# EAGLE design ble-v-monitor (EAGLE 7.2.0)
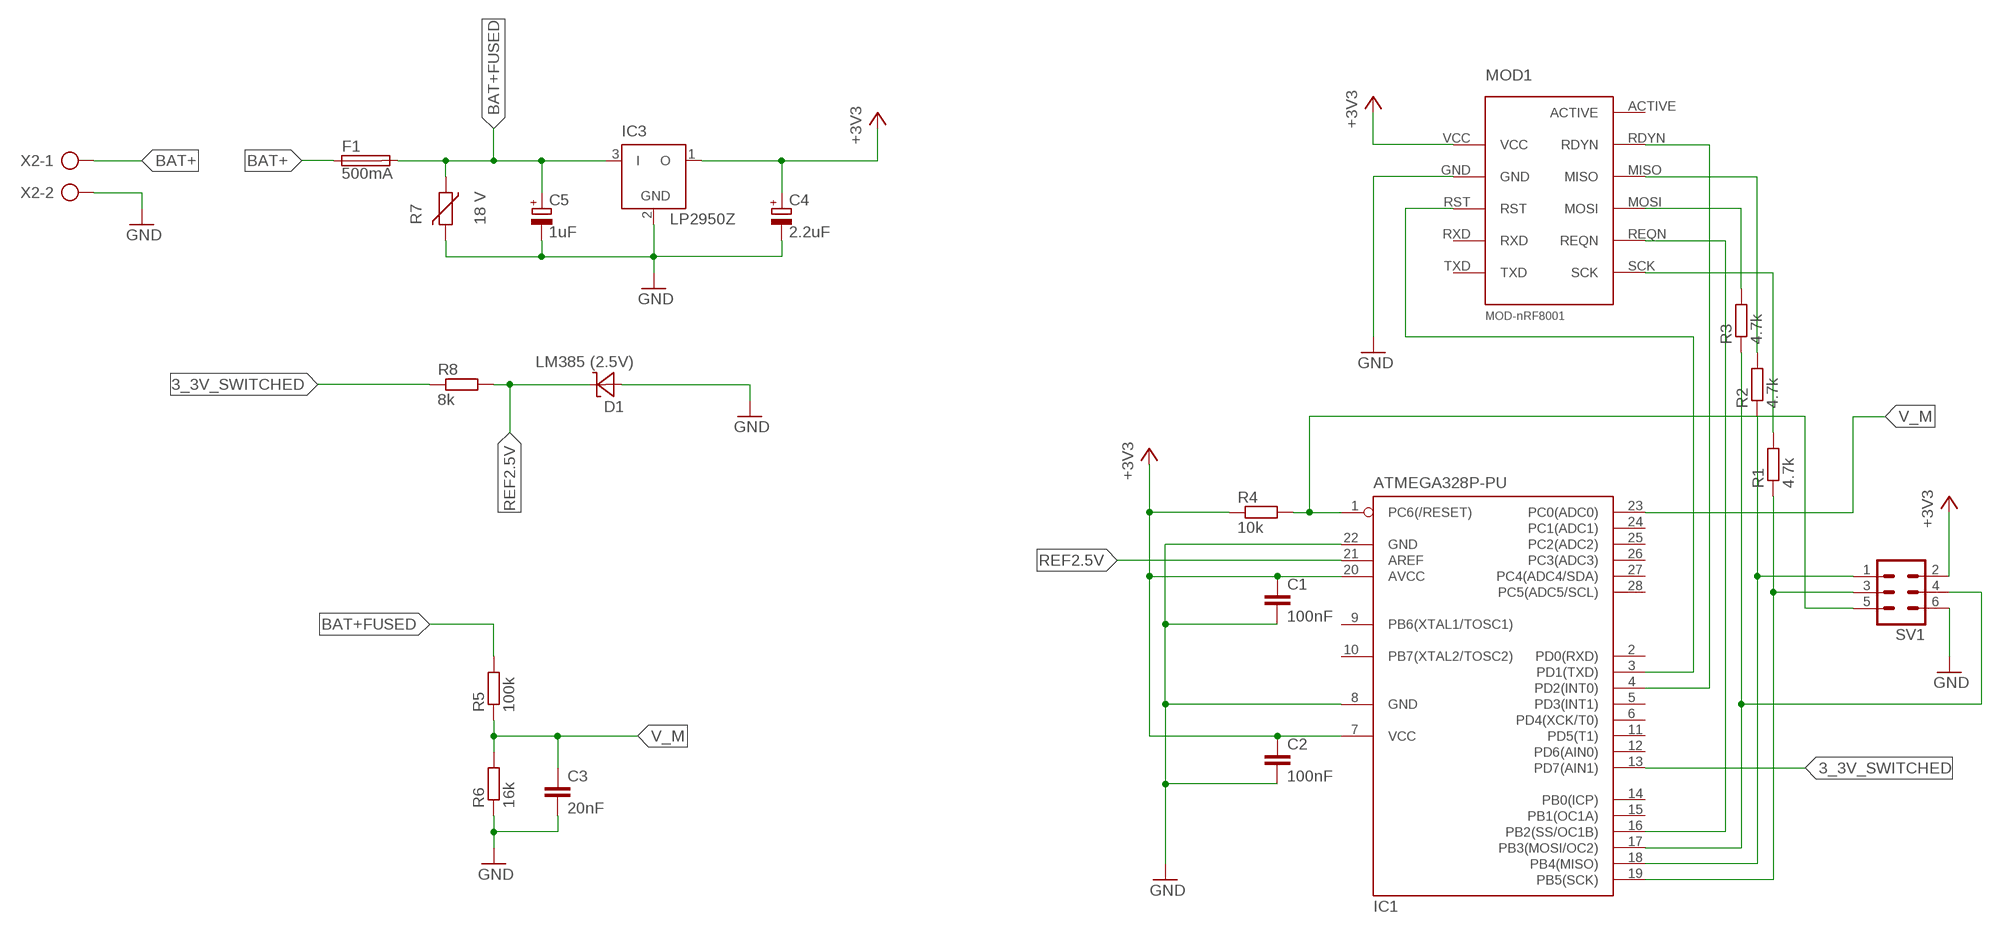
[diagram p0: schematic, sheet 1]

## Parts
C1  100nF  C-EU050-024X044  [C050-024X044]
C2  100nF  C-EU050-024X044  [C050-024X044]
C3  20nF  C-EU050-024X044  [C050-024X044]
C4  2.2uF  CPOL-EUTT2D5  [TT2D5]
C5  1uF  CPOL-EUTT2D5  [TT2D5]
D1  LM385 (2.5V)  LM385  [TO-92]
F1  500mA  SH22,5  [SH22,5]
IC1  ATMEGA328P-PU  MEGA8-P  [DIL28-3]
IC3  LP2950Z  [TO92]
MOD1  MOD-NRF8001MOD-NRF8001  [MOD-NRF8001]
R1  4.7k  R-EU_0207/7  [0207/7]
R2  4.7k  R-EU_0207/7  [0207/7]
R3  4.7k  R-EU_0207/7  [0207/7]
R4  10k  R-EU_0207/7  [0207/7]
R5  100k  R-EU_0207/7  [0207/7]
R6  16k  R-EU_0207/7  [0207/7]
R7  18 V  VARISTORCN0805  [CT/CN0805]
R8  8k  R-EU_0207/7  [0207/7]
SV1  MA03-2  [MA03-2]
X2  AK500/2  [AK500/2]

## Nets
3_3V_SWITCHED: IC1.13(PD7(AIN1)) R8.1
+3V3: C1.1 C2.1 C4.+ IC1.7(VCC) IC1.20(AVCC) IC3.1(O) MOD1.VCC R4.1 SV1.2
BAT+: F1.1 X2.1
BAT+FUSED: C5.+ F1.2 IC3.3(I) R5.2 R7.1
GND: C1.2 C2.2 C3.2 C4.- C5.- D1.+ IC1.8(GND) IC1.22(GND) IC3.2(GND) MOD1.GND R6.1 R7.2 SV1.6 X2.2
N$1: MOD1.MOSI R3.2
N$2: IC1.1(PC6(/RESET)) R4.2 SV1.5
N$4: MOD1.SCK R1.2
N$5: IC1.19(PB5(SCK)) R1.1 SV1.3
N$6: MOD1.MISO R2.2
N$8: IC1.16(PB2(SS/OC1B)) MOD1.REQN
N$10: IC1.17(PB3(MOSI/OC2)) R3.1 SV1.4
N$11: IC1.3(PD1(TXD)) MOD1.RST
N$12: IC1.18(PB4(MISO)) R2.1 SV1.1
N$16: IC1.4(PD2(INT0)) MOD1.RDYN
REF2.5V: D1.- IC1.21(AREF) R8.2
V_M: C3.1 IC1.23(PC0(ADC0)) R5.1 R6.2
Unconnected: IC1.2(PD0(RXD)) IC1.5(PD3(INT1)) IC1.6(PD4(XCK/T0)) IC1.9(PB6(XTAL1/TOSC1)) IC1.10(PB7(XTAL2/TOSC2)) IC1.11(PD5(T1)) IC1.12(PD6(AIN0)) IC1.14(PB0(ICP)) IC1.15(PB1(OC1A)) IC1.24(PC1(ADC1)) IC1.25(PC2(ADC2)) IC1.26(PC3(ADC3)) IC1.27(PC4(ADC4/SDA)) IC1.28(PC5(ADC5/SCL)) MOD1.ACTIVE MOD1.RXD MOD1.TXD

## Library data of the parts
C1-C3 = rcl:C-EU: CAPACITOR, European symbol
C4 C5 = rcl:CPOL-EU: POLARIZED CAPACITOR, European symbol
D1 = lm385:LM385: LM385 LM385 Micropower Voltage Reference
F1 = fuse:SH22,5: FUSE HOLDER grid 22,5 mm, OGN0031 8201, Schurter (Buerklin); MF: SCHURTER; MPN: 0031.8201; OC_FARNELL: 1162740; OC_NEWARK: 96F8317
IC1 = atmel:MEGA8-P: MICROCONTROLLER 8 Kbytes FLASH, 1 kbytes SRAM, 512 bytes EEPROM, USART, 4-channel 10 bit ADC, 2-channel 8 bit ADC Pin compatible with Atmega48, ATMega88, ATMega168 Source: avr.lbr; OC_FARNELL: unknown; OC_NEWARK: unknown
IC3 = linear:LP2950: 100 mA, Low Power Low Dropout Voltage Regulator Source: http://www.onsemi.com/pub/Collateral/LP2950-D.PDF
MOD1 = frankduerr:MOD-NRF8001
R1-R6 R8 = rcl:R-EU_: RESISTOR, European symbol
R7 = varistor:VARISTOR: VARISTOR
SV1 = con-lstb:MA03-2: PIN HEADER; OC_FARNELL: unknown; OC_NEWARK: unknown
X2 = con-ptr500:AK500/2: CONNECTOR; OC_FARNELL: unknown; OC_NEWARK: unknown

## Board
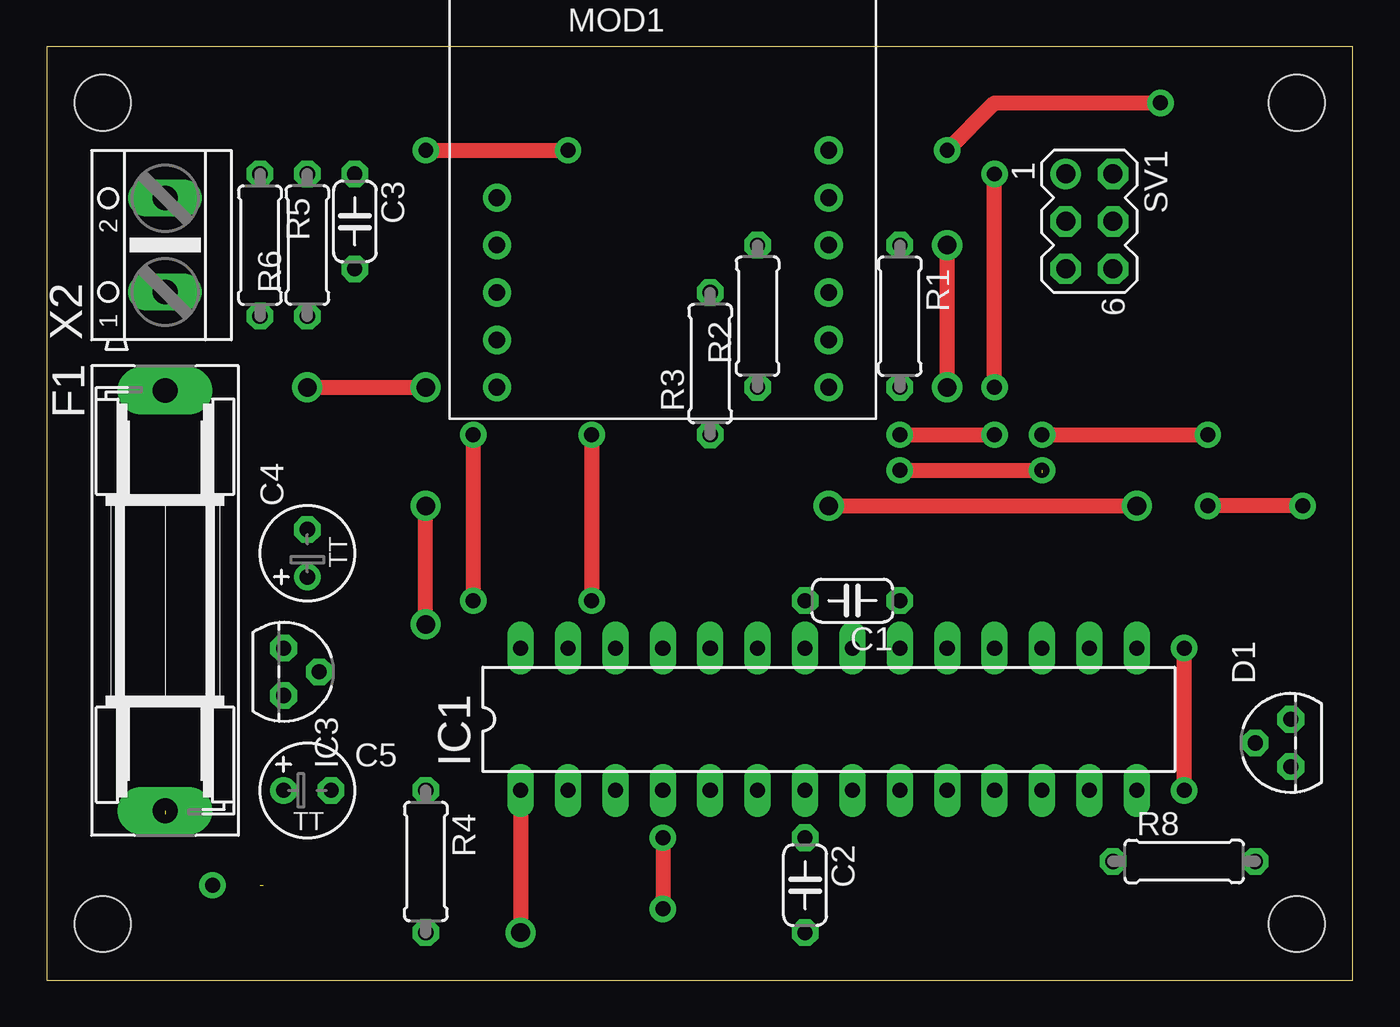
[diagram p1: board, top side]
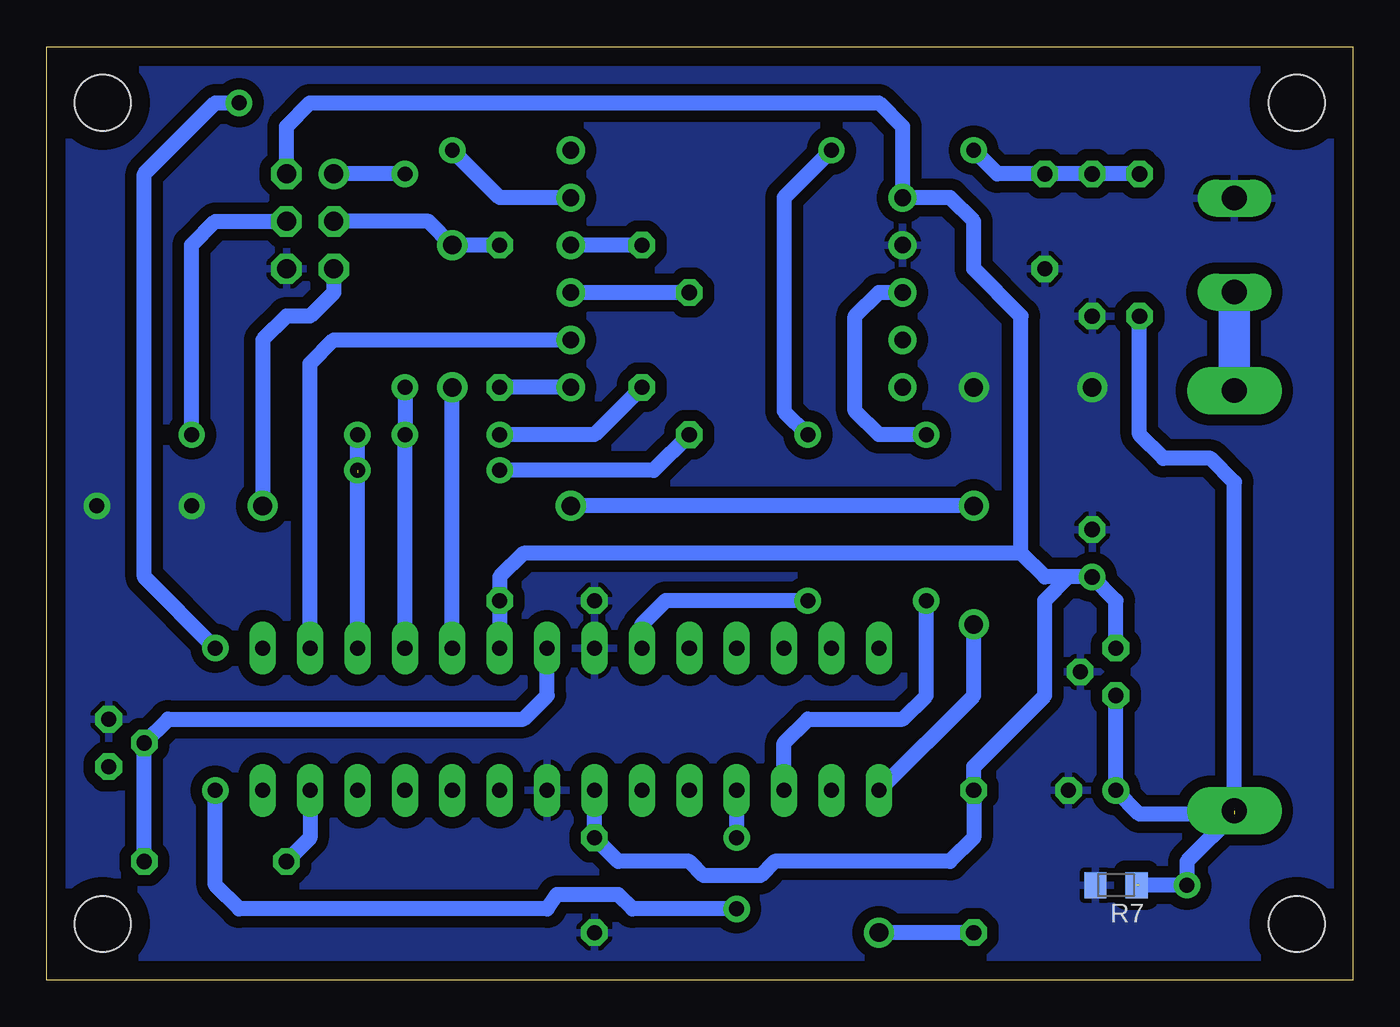
[diagram p2: board, bottom side, seen from below]

Size 70 x 50 mm. Coordinates in mm from the lower left corner, seen from the top.
Outline: 0,0 70,0 70,50 0,50 0,0
Copper layers (1*16): Top 0.035mm / dielectric 1.5mm / Bottom 0.035mm
Design rules "default *": minimum track width 10mil, minimum drill 24mil, track to track 24mil, track to pad 24mil, pad to pad 24mil, via to via 24mil, smd to smd 8mil, copper to edge 40mil, drill to drill 8mil, minimum pad ring 12mil, minimum via ring 12mil, stop-mask expansion 4mil, vias tented up to drill 0mil, thermal gap 10mil
Holes 3 mm at 3,47 3,3 67,3 67,47

### Footprints (pad centres in the part's own frame; a part is rotated, then mirrored left to right if it is on the bottom)
C050-024X044 = drill 0.813 octagon: 1 -2.54,0; 2 2.54,0
TT2D5 = drill 0.813: + -1.27,0 | drill 0.813 octagon: - 1.27,0
TO-92 = drill 0.813 octagon: + 1.27,0; - 0,1.905; NC -1.27,0
SH22,5 = drill 1.321 pad 2.54 long: 1 -11.252,0; 2 11.252,0
DIL28-3 = drill 0.813 long: 1 -16.51,-3.81; 2 -13.97,-3.81; 3 -11.43,-3.81; 4 -8.89,-3.81; 5 -6.35,-3.81; 6 -3.81,-3.81; 7 -1.27,-3.81; 8 1.27,-3.81; 9 3.81,-3.81; 10 6.35,-3.81; 11 8.89,-3.81; 12 11.43,-3.81; 13 13.97,-3.81; 14 16.51,-3.81; 15 16.51,3.81; 16 13.97,3.81; 17 11.43,3.81; 18 8.89,3.81; 19 6.35,3.81; 20 3.81,3.81; 21 1.27,3.81; 22 -1.27,3.81; 23 -3.81,3.81; 24 -6.35,3.81; 25 -8.89,3.81; 26 -11.43,3.81; 27 -13.97,3.81; 28 -16.51,3.81
TO92 = drill 0.813 octagon: 1 -1.27,0; 2 0,1.905; 3 1.27,0
MOD-NRF8001 = drill 0.9: ACTIVE 8.89,-1.27; GND -8.89,-6.35; MISO 8.89,-6.35; MOSI 8.89,-8.89; RDYN 8.89,-3.81; REQN 8.89,-11.43; RST -8.89,-8.89; RXD -8.89,-11.43; SCK 8.89,-13.97; TXD -8.89,-13.97; VCC -8.89,-3.81
0207/7 = drill 0.813 octagon: 1 -3.81,0; 2 3.81,0
CT/CN0805 = smd 1.2 x 1.4: 1 -1.1,0; 2 1.1,0
MA03-2 = drill 1.016: 1 -2.54,-1.27 | drill 1.016 octagon: 2 -2.54,1.27; 3 0,-1.27; 4 0,1.27; 5 2.54,-1.27; 6 2.54,1.27
AK500/2 = drill 1.321 long: 1 -2.515,0; 2 2.515,0

### Placement (x,y rotation side)
C1  43.18,20.32 180 top
C2  40.64,5.08 270 top
C3  16.51,40.64 270 top
C4  13.97,22.86 90 top
C5  13.97,10.16 0 top
D1  66.67,12.7 90 top
F1  6.35,20.32 270 top
IC1  41.91,13.97 0 top
IC3  12.7,16.51 270 top
MOD1  33.02,45.72 0 top
R1  45.72,35.56 270 top
R2  38.1,35.56 90 top
R3  35.56,33.02 90 top
R4  20.32,6.35 270 top
R5  11.43,39.37 270 top
R6  13.97,39.37 90 top
R7  12.7,5.08 180 bottom
R8  60.96,6.35 0 top
SV1  55.88,40.64 270 top
X2  6.35,39.37 90 top

### Tracks (layer width: path | path; a pad name or v marks a point on that pad's centre or on a via)
3_3V_SWITCHED
  Bottom 0.813: IC1.13 55.88,7.62 R8.1
+3V3
  Bottom 0.813: IC1.7 C2.1 39.37,6.35 35.56,6.35 34.8,5.59 31.75,5.59 30.99,6.35 21.59,6.35 20.32,7.62 R4.1 20.32,11.43 16.51,15.24 16.51,20.32 15.24,21.59 | 15.24,21.59 C4.+ 12.7,20.32 IC3.1 | 15.24,21.59 16.51,21.59 17.78,22.86 | 17.78,22.86 17.78,35.56 20.32,38.1 20.32,40.64 21.59,41.91 MOD1.VCC 24.13,45.72 25.4,46.99 55.88,46.99 57.15,45.72 SV1.2 | IC1.20 C1.1 45.72,21.59 44.45,22.86 17.78,22.86
BAT+
  Bottom 1.676: F1.1 X2.1
BAT+FUSED  (via drill 0.8)  (2 unrouted)
  Bottom 0.813: 6.35,8.89 8.89,6.35 v8.89,5.08 11.43,5.08 | 6.35,8.89 6.35,26.67 7.62,27.94 10.16,27.94 11.43,29.21 R5.2 | 6.35,8.89 11.43,8.89 C5.+ IC3.3
GND  (via drill 0.8, 1)
  Top 0.813: v13.97,31.75 v20.32,31.75 | v67.31,25.4 v62.23,25.4
  pour Bottom: -1.27,50.8 101.6,50.8 101.6,-1.27 -1.27,-1.27
N$1
  Bottom 0.813: R3.2 MOD1.MOSI
N$2  (via drill 1)
  Top 0.813: v20.32,19.05 v20.32,25.4 | IC1.1 v25.4,2.54 | v41.91,25.4 v58.42,25.4
  Bottom 0.813: R4.2 v25.4,2.54 | v20.32,25.4 v41.91,25.4 | SV1.5 54.61,36.83 55.88,35.56 57.15,35.56 58.42,34.29 v58.42,25.4 | IC1.1 20.32,15.24 v20.32,19.05
N$4
  Bottom 0.813: MOD1.SCK R1.2
N$5  (via drill 1)
  Top 0.813: v48.26,31.75 v48.26,39.37
  Bottom 0.813: R1.1 v48.26,39.37 49.53,40.64 SV1.3 | IC1.19 v48.26,31.75
N$6
  Bottom 0.813: R2.2 MOD1.MISO
N$8
  Bottom 0.813: IC1.16 55.88,33.02 54.61,34.29 MOD1.REQN
N$10  (via drill 0.8)  (1 unrouted)
  Top 0.813: v45.72,27.3 v53.34,27.3 | v53.34,29.21 v62.23,29.21
  Bottom 0.813: IC1.17 53.34,27.18 | R3.1 37.47,27.3 v45.72,27.3 | v53.34,27.3 v53.34,29.21 | v62.23,29.21 62.23,39.37 60.96,40.64 SV1.4
N$11  (via drill 0.8)
  Top 0.813: v22.86,29.21 v22.86,20.32
  Bottom 0.813: IC1.3 30.48,12.7 29.21,13.97 24.13,13.97 22.86,15.24 v22.86,20.32 | MOD1.RST 25.4,36.83 26.67,35.56 26.67,30.48 25.4,29.21 v22.86,29.21
N$12  (via drill 0.8)
  Top 0.813: v45.72,29.21 v50.8,29.21 | v50.8,31.75 v50.8,43.18
  Bottom 0.813: IC1.18 v50.8,29.21 v50.8,31.75 | R2.1 40.64,29.21 v45.72,29.21 | v50.8,43.18 SV1.1
N$16  (via drill 0.8)
  Top 0.813: v33.02,7.62 v33.02,3.81 | v60.96,10.16 v60.96,17.78 | v48.26,44.45 50.8,46.99 v59.69,46.99
  Bottom 0.813: IC1.4 v33.02,7.62 | v33.02,3.81 38.61,3.81 39.37,4.57 42.67,4.57 43.18,3.81 59.69,3.81 60.96,5.08 v60.96,10.16 | MOD1.RDYN 45.72,41.91 v48.26,44.45 | v60.96,17.78 64.77,21.59 64.77,43.18 60.96,46.99 v59.69,46.99
REF2.5V
  Bottom 0.813: R8.2 D1.- 63.5,13.97 44.45,13.97 43.18,15.24 IC1.21
V_M  (via drill 0.8)
  Top 0.813: v20.32,44.45 v27.94,44.45 | v29.21,29.21 v29.21,20.32
  Bottom 0.813: R5.1 R6.2 C3.1 19.05,43.18 v20.32,44.45 | v27.94,44.45 30.48,41.91 30.48,30.48 v29.21,29.21 | v29.21,20.32 36.83,20.32 38.1,19.05 IC1.23